# Altium project Robot_board.PrjPCB
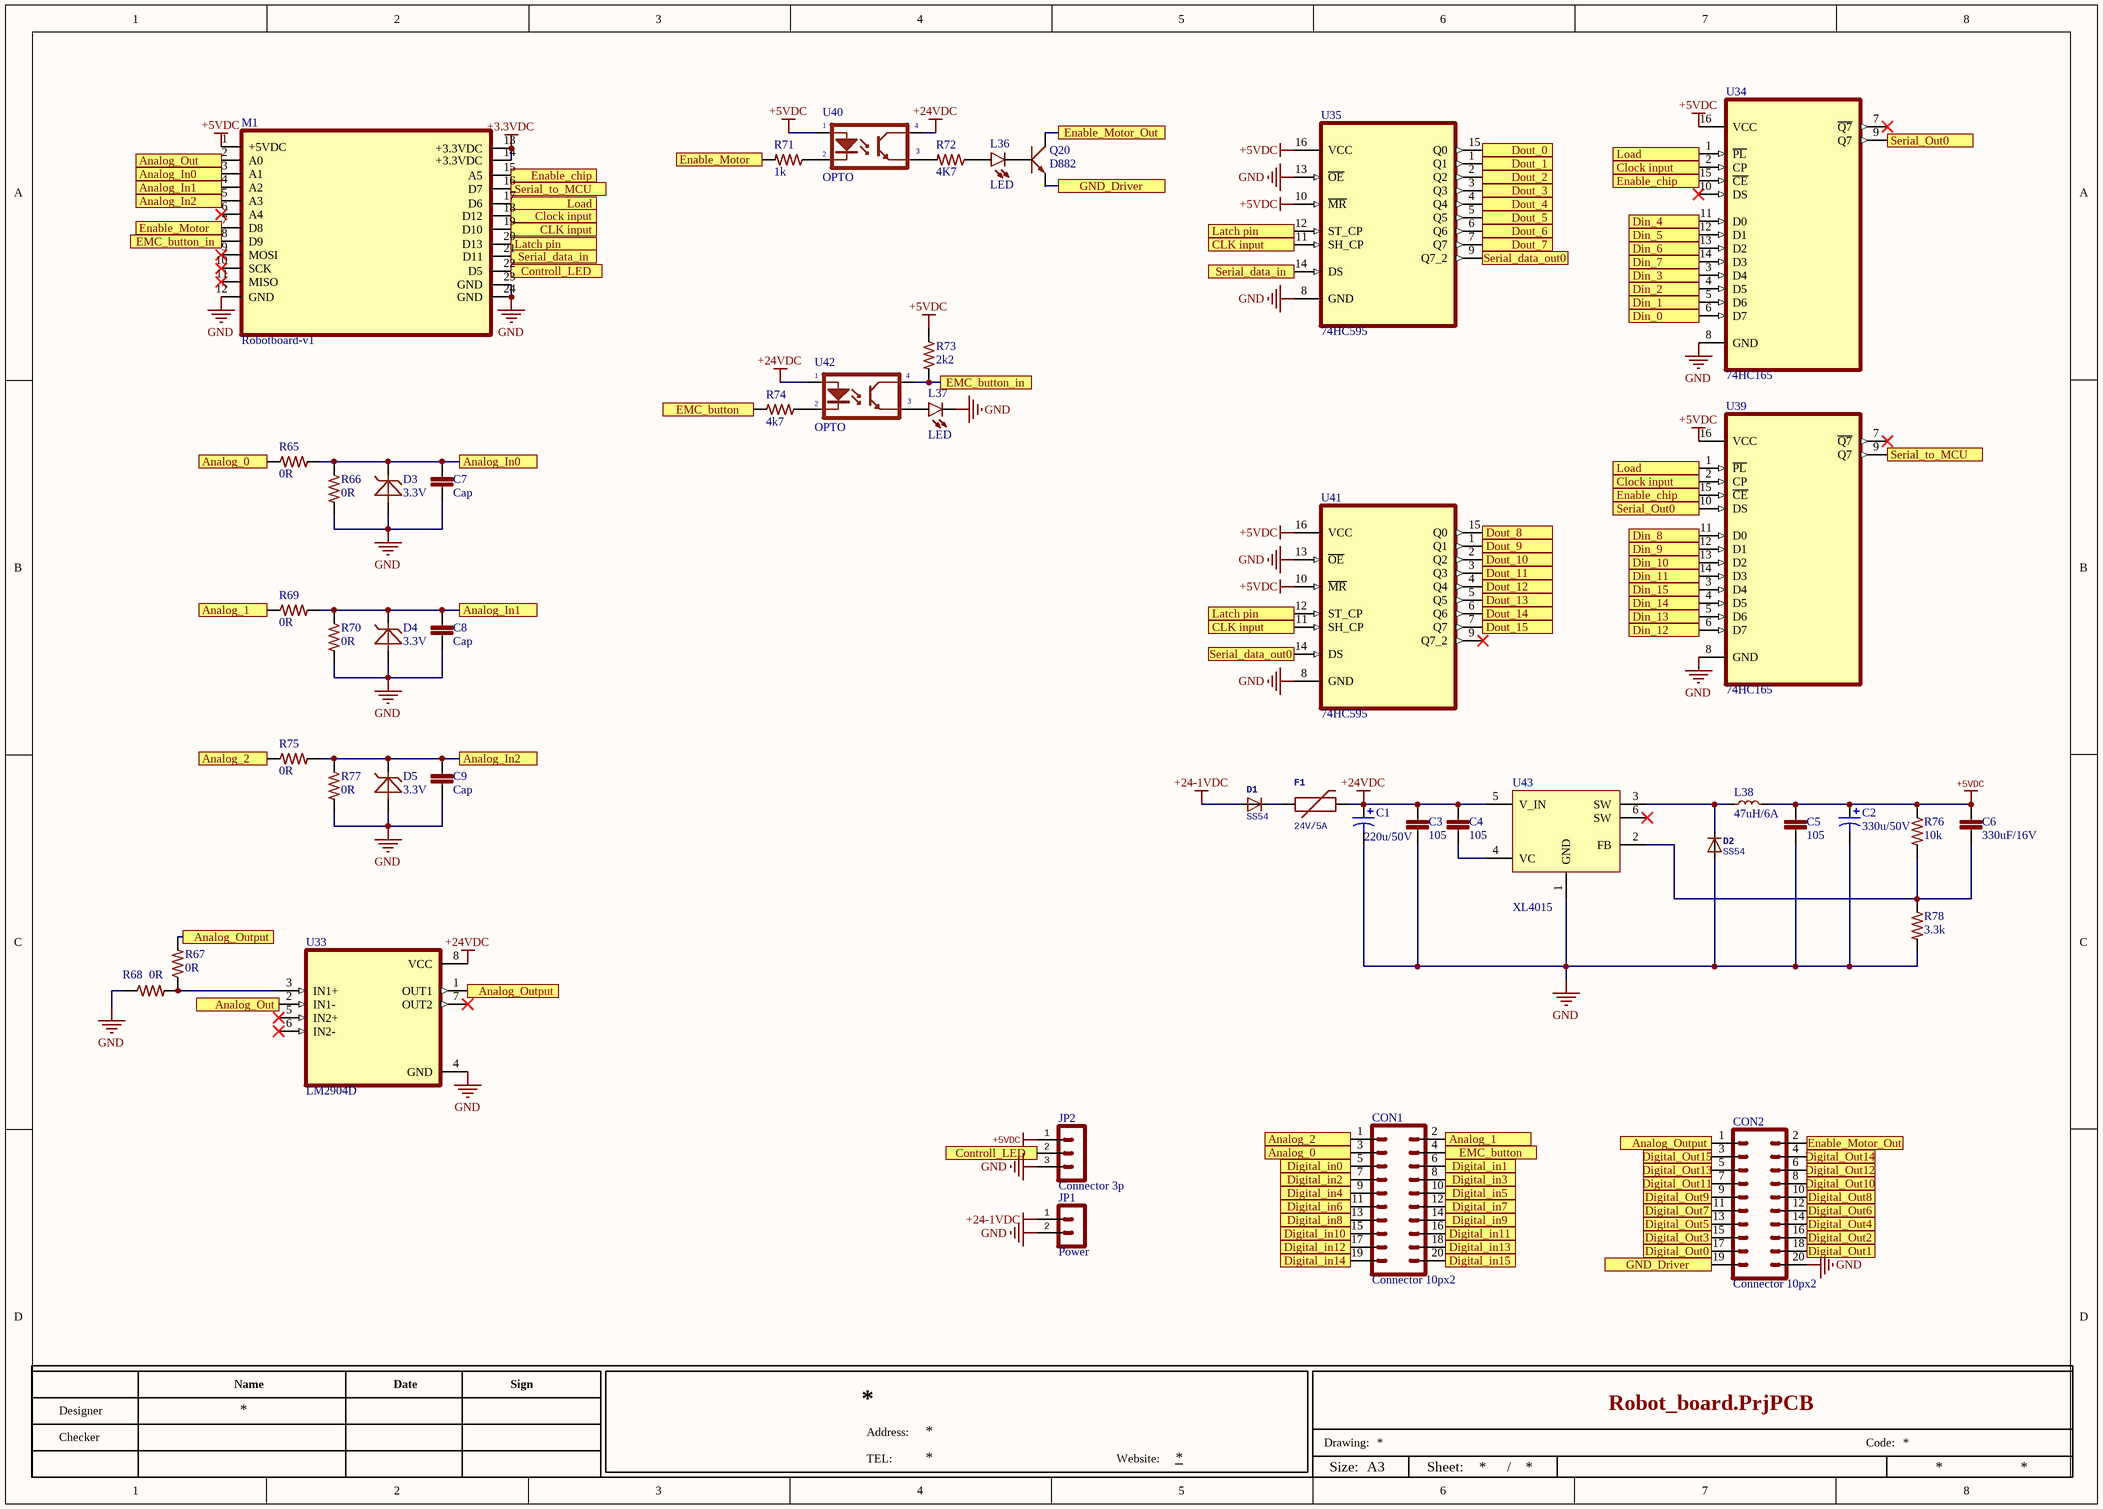
[diagram p0: Robot_board.SchDoc]
2 sheets, 190 parts. Net scope: flat (ports and power ports of the same name join across sheets).
Board file: robot.PcbDoc
Sheets:
  Robot_board.SchDoc
  In_Out.SchDoc

## Sheet Robot_board.SchDoc
size A3

### Parts
C1  220u/50V  [CAP_SMD_8x10]
C2  330u/50V  [CAP_SMD_8x10]
C3  105  [CAP_SMD0603]
C4  105  [CAP_SMD0603]
C5  105  [CAP_SMD0603]
C6  330uF/16V  [CAP_SMD0603]
C7  Cap  [CAP_SMD0603]
C8  Cap  [CAP_SMD0603]
C9  Cap  [CAP_SMD0603]
CON1  Connector 10px2  [DG24-2KDS]
CON2  Connector 10px2  [DG24-2KDS]
D1  SS54  [SMB]
D2  SS54  [SMB]
D3  3.3V  [DIODE_ZENER_SMD]
D4  3.3V  [DIODE_ZENER_SMD]
D5  3.3V  [DIODE_ZENER_SMD]
F1  24V/5A  [1206]
JP1  Power  [KF-128_2P]
JP2  Connector 3p  [KF-128_3P]
L36  LED  [LED_GREEN_SMD_0603]
L37  LED  [LED_RED_SMD_0603]
L38  47uH/6A  [Inductor_47uH_6A]
M1  Robotboard-v1  [ROBOTBOARD_V1]
Q20  D882  [SOT89]
R65  0R  [RES_SMD0603]
R66  0R  [RES_SMD0603]
R67  0R  [RES_SMD0603]
R68  0R  [RES_SMD0603]
R69  0R  [RES_SMD0603]
R70  0R  [RES_SMD0603]
R71  1k  [RES_SMD0603]
R72  4K7  [RES_SMD0603]
R73  2k2  [RES_SMD0603]
R74  4k7  [RES_SMD0603]
R75  0R  [RES_SMD0603]
R76  10k  [RES_SMD0603]
R77  0R  [RES_SMD0603]
R78  3.3k  [RES_SMD0603]
U33  LM2904D  [SOIC 8]
U34  74HC165  [SOIC16]
U35  74HC595  [SOIC16]
U39  74HC165  [SOIC16]
U40  OPTO  [SOP4]
U41  74HC595  [SOIC16]
U42  OPTO  [SOP4]
U43  XL4015  [TO-263-5]

### Ports
Analog_0, Analog_1, Analog_2, Analog_In0, Analog_In1, Analog_In2, Analog_Out, Analog_Output, CLK input, Clock input, Controll_LED, Digital_in0, Digital_in1, Digital_in2, Digital_in3, Digital_in4, Digital_in5, Digital_in6, Digital_in7, Digital_in8, Digital_in9, Digital_in10, Digital_in11, Digital_in12, Digital_in13, Digital_in14, Digital_in15, Digital_Out0, Digital_Out1, Digital_Out2, Digital_Out3, Digital_Out4, Digital_Out5, Digital_Out6, Digital_Out7, Digital_Out8, Digital_Out9, Digital_Out10, Digital_Out11, Digital_Out12, Digital_Out13, Digital_Out14, Digital_Out15, Din_0, Din_1, Din_2, Din_3, Din_4, Din_5, Din_6, Din_7, Din_8, Din_9, Din_10, Din_11, Din_12, Din_13, Din_14, Din_15, Dout_0, Dout_1, Dout_2, Dout_3, Dout_4, Dout_5, Dout_6, Dout_7, Dout_8, Dout_9, Dout_10, Dout_11, Dout_12, Dout_13, Dout_14, Dout_15, EMC_button, EMC_button_in, Enable_chip, Enable_Motor, Enable_Motor_Out, GND_Driver, Latch pin, Load, Serial_data_in, Serial_data_out0, Serial_Out0, Serial_to_MCU

### Nets
+3.3VDC: M1.13(+3.3VDC) M1.14(+3.3VDC)
+5VDC: C2.1 C5.1 C6.1 JP2.1 L38.2 M1.1(+5VDC) R73.1 R76.1 U34.16(VCC) U35.10(~{MR}) U35.16(VCC) U39.16(VCC) U40.1(A) U41.10(~{MR}) U41.16(VCC)
+24-1VDC: D1.1 JP1.1
+24VDC: C1.1 C3.1 C4.1 F1.2 U33.8(VCC) U40.4(C) U42.1(A) U43.5(V_IN)
GND: C1.2 C2.2 C3.2 C5.2 C7.1 C8.1 C9.1 CON2.20 D2.1 D3.1 D4.1 D5.1 JP1.2 JP2.3 L37.2(POS) M1.12(GND) M1.23(GND) M1.24(GND) R66.2 R68.1 R70.2 R77.2 R78.2 U33.4(GND) U34.8(GND) U35.8(GND) U35.13(~{OE}) U39.8(GND) U41.8(GND) U41.13(~{OE}) U43.1(GND)
NetC4_2: C4.2 U43.4(VC)
NetC6_2: C6.2 R76.2 R78.1 U43.2(FB)
NetC7_2: C7.2 D3.2 M1.3(A1) R65.2 R66.1 ; port Analog_In0
NetC8_2: C8.2 D4.2 M1.4(A2) R69.2 R70.1 ; port Analog_In1
NetC9_2: C9.2 D5.2 M1.5(A3) R75.2 R77.1 ; port Analog_In2
NetCON1_1: CON1.1 R75.1 ; port Analog_2
NetCON1_2: CON1.2 R69.1 ; port Analog_1
NetCON1_3: CON1.3 R65.1 ; port Analog_0
NetCON1_4: CON1.4 R74.2 ; port EMC_button
NetCON1_5: CON1.5 ; port Digital_in0
NetCON1_6: CON1.6 ; port Digital_in1
NetCON1_7: CON1.7 ; port Digital_in2
NetCON1_8: CON1.8 ; port Digital_in3
NetCON1_9: CON1.9 ; port Digital_in4
NetCON1_10: CON1.10 ; port Digital_in5
NetCON1_11: CON1.11 ; port Digital_in6
NetCON1_12: CON1.12 ; port Digital_in7
NetCON1_13: CON1.13 ; port Digital_in8
NetCON1_14: CON1.14 ; port Digital_in9
NetCON1_15: CON1.15 ; port Digital_in10
NetCON1_16: CON1.16 ; port Digital_in11
NetCON1_17: CON1.17 ; port Digital_in12
NetCON1_18: CON1.18 ; port Digital_in13
NetCON1_19: CON1.19 ; port Digital_in14
NetCON1_20: CON1.20 ; port Digital_in15
NetCON2_1: CON2.1 R67.2 U33.1(OUT1) ; port Analog_Output
NetCON2_2: CON2.2 Q20.3(COLLECTOR) ; port Enable_Motor_Out
NetCON2_3: CON2.3 ; port Digital_Out15
NetCON2_4: CON2.4 ; port Digital_Out14
NetCON2_5: CON2.5 ; port Digital_Out13
NetCON2_6: CON2.6 ; port Digital_Out12
NetCON2_7: CON2.7 ; port Digital_Out11
NetCON2_8: CON2.8 ; port Digital_Out10
NetCON2_9: CON2.9 ; port Digital_Out9
NetCON2_10: CON2.10 ; port Digital_Out8
NetCON2_11: CON2.11 ; port Digital_Out7
NetCON2_12: CON2.12 ; port Digital_Out6
NetCON2_13: CON2.13 ; port Digital_Out5
NetCON2_14: CON2.14 ; port Digital_Out4
NetCON2_15: CON2.15 ; port Digital_Out3
NetCON2_16: CON2.16 ; port Digital_Out2
NetCON2_17: CON2.17 ; port Digital_Out0
NetCON2_18: CON2.18 ; port Digital_Out1
NetCON2_19: CON2.19 Q20.2(EMITTER) ; port GND_Driver
NetD1_2: D1.2 F1.1
NetD2_2: D2.2 L38.1 U43.3(SW)
NetJP2_2: JP2.2 M1.22(D5) ; port Controll_LED
NetL36_1: L36.1(NEG) R72.1
NetL36_2: L36.2(POS) Q20.1(BASE)
NetL37_1: L37.1(NEG) U42.3(E)
NetM1_2: M1.2(A0) U33.2(IN1-) ; port Analog_Out
NetM1_7: M1.7(D8) R71.2 ; port Enable_Motor
NetM1_8: M1.8(D9) R73.2 U42.4(C) ; port EMC_button_in
NetM1_15: M1.15(A5) U34.15(~{CE}) U39.15(~{CE}) ; port Enable_chip
NetM1_16: M1.16(D7) U39.9(Q7) ; port Serial_to_MCU
NetM1_17: M1.17(D6) U34.1(~{PL}) U39.1(~{PL}) ; port Load
NetM1_18: M1.18(D12) U34.2(CP) U39.2(CP) ; port Clock input
NetM1_19: M1.19(D10) U35.11(SH_CP) U41.11(SH_CP) ; port CLK input
NetM1_20: M1.20(D13) U35.12(ST_CP) U41.12(ST_CP) ; port Latch pin
NetM1_21: M1.21(D11) U35.14(DS) ; port Serial_data_in
NetR1_2: U35.15(Q0) ; port Dout_0
NetR2_2: U41.15(Q0) ; port Dout_8
NetR3_2: U34.6(D7) ; port Din_0
NetR4_2: U39.11(D0) ; port Din_8
NetR9_2: U35.1(Q1) ; port Dout_1
NetR10_2: U41.1(Q1) ; port Dout_9
NetR13_2: U34.5(D6) ; port Din_1
NetR14_2: U39.12(D1) ; port Din_9
NetR17_2: U35.2(Q2) ; port Dout_2
NetR18_2: U41.2(Q2) ; port Dout_10
NetR19_2: U34.4(D5) ; port Din_2
NetR20_2: U39.13(D2) ; port Din_10
NetR25_2: U35.3(Q3) ; port Dout_3
NetR26_2: U41.3(Q3) ; port Dout_11
NetR27_2: U34.3(D4) ; port Din_3
NetR28_2: U39.14(D3) ; port Din_11
NetR33_2: U34.11(D0) ; port Din_4
NetR34_2: U39.6(D7) ; port Din_12
NetR35_2: U35.4(Q4) ; port Dout_4
NetR36_2: U41.4(Q4) ; port Dout_12
NetR41_2: U34.12(D1) ; port Din_5
NetR42_2: U39.5(D6) ; port Din_13
NetR43_2: U35.5(Q5) ; port Dout_5
NetR44_2: U41.5(Q5) ; port Dout_13
NetR49_2: U34.13(D2) ; port Din_6
NetR50_2: U39.4(D5) ; port Din_14
NetR51_2: U35.6(Q6) ; port Dout_6
NetR52_2: U41.6(Q6) ; port Dout_14
NetR57_2: U34.14(D3) ; port Din_7
NetR58_2: U39.3(D4) ; port Din_15
NetR59_2: U35.7(Q7) ; port Dout_7
NetR60_2: U41.7(Q7) ; port Dout_15
NetR67_1: R67.1 R68.2 U33.3(IN1+)
NetR71_1: R71.1 U40.2(K)
NetR72_2: R72.2 U40.3(E)
NetR74_1: R74.1 U42.2(K)
NetU34_9: U34.9(Q7) U39.10(DS) ; port Serial_Out0
NetU35_9: U35.9(Q7_2) U41.14(DS) ; port Serial_data_out0

Not connected (* = marked no-connect by the designer): M1 6(A4)* 9(MOSI)* 10(SCK)* 11(MISO)*; U33 5(IN2+)* 6(IN2-)* 7(OUT2)*; U34 7(~{Q7})* 10(DS)*; U39 7(~{Q7})*; U41 9(Q7_2)*; U43 6(SW)*

### Notes on the sheet
- Name
- Date
- Sign
- Designer
- Checker
- Address:
- TEL:
- Website:
- Drawing:
- Size:
- A3
- Sheet:
- /
- Code:

### Library data of the parts
C1 C2 = Cap_Pol
C3-C6 = Cap
D1 D2 = DIODE
D3-D5 = DIODE_ZENER: Diode
F1 = Fuse
JP1 = Connector 2p
L36 L37 = LED: Lighting Eminter Diode
L38 = Inductors
Q20 = Tranzitor NPN: pin to pad: 2>3 3>2
R65-R78 = Resistor

## Sheet In_Out.SchDoc
size A3
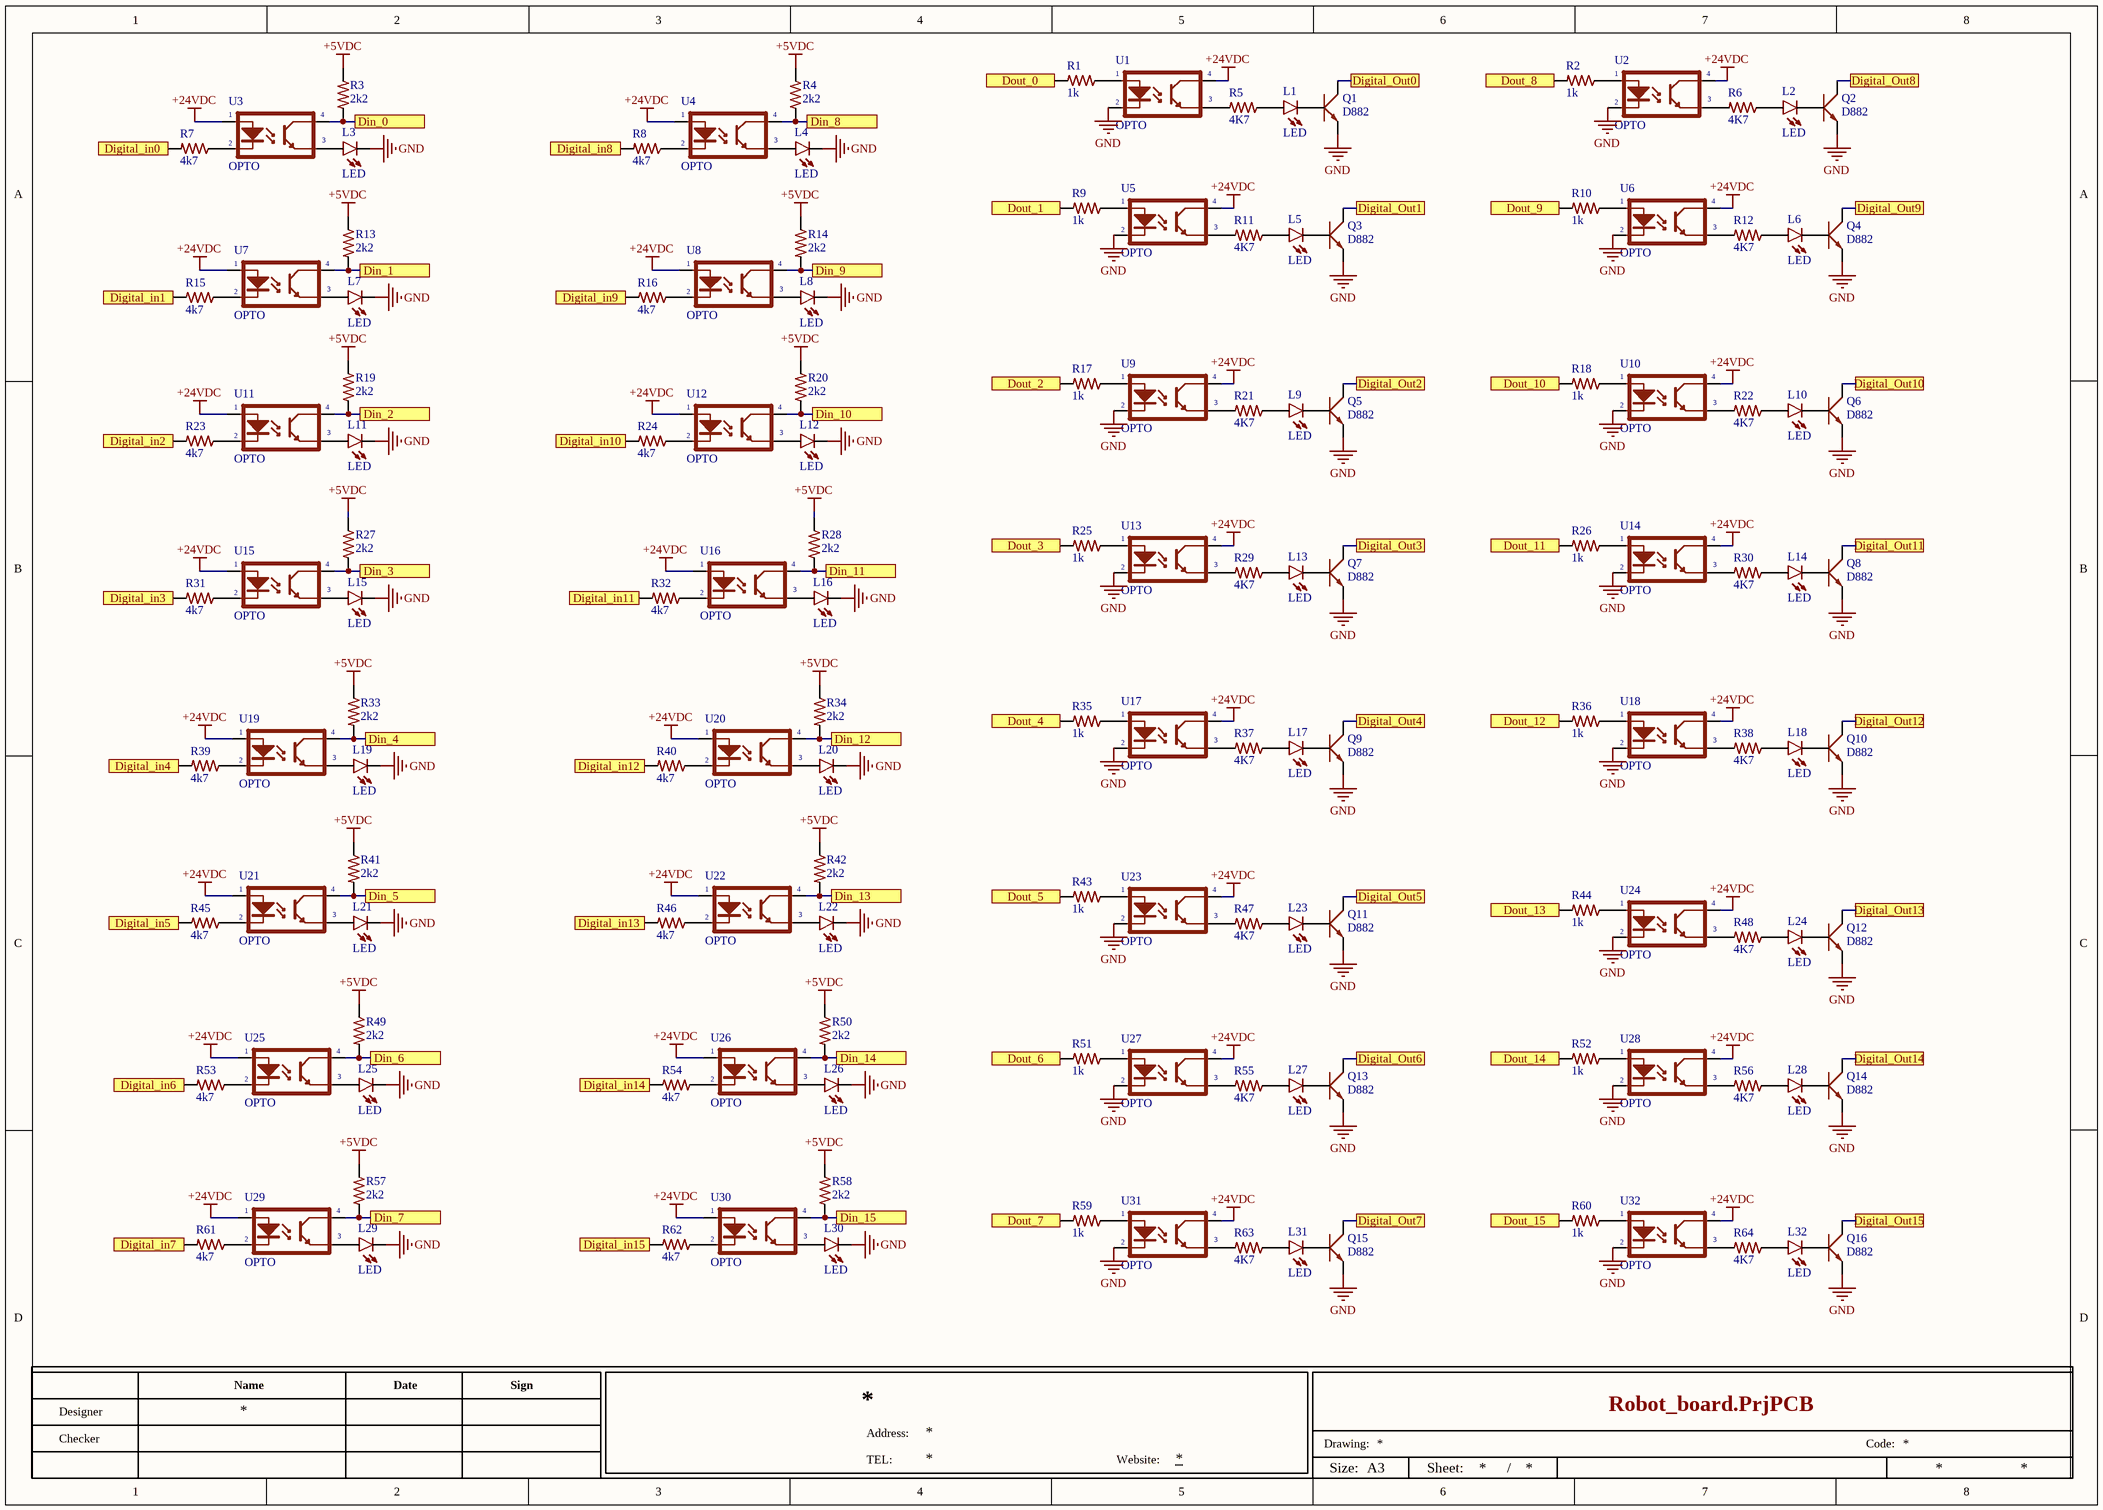
[diagram p1: In_Out.SchDoc]

### Parts
L1  LED  [LED_GREEN_SMD_0603]
L2  LED  [LED_GREEN_SMD_0603]
L3  LED  [LED_RED_SMD_0603]
L4  LED  [LED_RED_SMD_0603]
L5  LED  [LED_GREEN_SMD_0603]
L6  LED  [LED_GREEN_SMD_0603]
L7  LED  [LED_RED_SMD_0603]
L8  LED  [LED_RED_SMD_0603]
L9  LED  [LED_GREEN_SMD_0603]
L10  LED  [LED_GREEN_SMD_0603]
L11  LED  [LED_RED_SMD_0603]
L12  LED  [LED_RED_SMD_0603]
L13  LED  [LED_GREEN_SMD_0603]
L14  LED  [LED_GREEN_SMD_0603]
L15  LED  [LED_RED_SMD_0603]
L16  LED  [LED_RED_SMD_0603]
L17  LED  [LED_GREEN_SMD_0603]
L18  LED  [LED_GREEN_SMD_0603]
L19  LED  [LED_RED_SMD_0603]
L20  LED  [LED_RED_SMD_0603]
L21  LED  [LED_RED_SMD_0603]
L22  LED  [LED_RED_SMD_0603]
L23  LED  [LED_GREEN_SMD_0603]
L24  LED  [LED_GREEN_SMD_0603]
L25  LED  [LED_RED_SMD_0603]
L26  LED  [LED_RED_SMD_0603]
L27  LED  [LED_GREEN_SMD_0603]
L28  LED  [LED_GREEN_SMD_0603]
L29  LED  [LED_RED_SMD_0603]
L30  LED  [LED_RED_SMD_0603]
L31  LED  [LED_GREEN_SMD_0603]
L32  LED  [LED_GREEN_SMD_0603]
Q1  D882  [SOT89]
Q2  D882  [SOT89]
Q3  D882  [SOT89]
Q4  D882  [SOT89]
Q5  D882  [SOT89]
Q6  D882  [SOT89]
Q7  D882  [SOT89]
Q8  D882  [SOT89]
Q9  D882  [SOT89]
Q10  D882  [SOT89]
Q11  D882  [SOT89]
Q12  D882  [SOT89]
Q13  D882  [SOT89]
Q14  D882  [SOT89]
Q15  D882  [SOT89]
Q16  D882  [SOT89]
R1  1k  [RES_SMD0603]
R2  1k  [RES_SMD0603]
R3  2k2  [RES_SMD0603]
R4  2k2  [RES_SMD0603]
R5  4K7  [RES_SMD0603]
R6  4K7  [RES_SMD0603]
R7  4k7  [RES_SMD0603]
R8  4k7  [RES_SMD0603]
R9  1k  [RES_SMD0603]
R10  1k  [RES_SMD0603]
R11  4K7  [RES_SMD0603]
R12  4K7  [RES_SMD0603]
R13  2k2  [RES_SMD0603]
R14  2k2  [RES_SMD0603]
R15  4k7  [RES_SMD0603]
R16  4k7  [RES_SMD0603]
R17  1k  [RES_SMD0603]
R18  1k  [RES_SMD0603]
R19  2k2  [RES_SMD0603]
R20  2k2  [RES_SMD0603]
R21  4K7  [RES_SMD0603]
R22  4K7  [RES_SMD0603]
R23  4k7  [RES_SMD0603]
R24  4k7  [RES_SMD0603]
R25  1k  [RES_SMD0603]
R26  1k  [RES_SMD0603]
R27  2k2  [RES_SMD0603]
R28  2k2  [RES_SMD0603]
R29  4K7  [RES_SMD0603]
R30  4K7  [RES_SMD0603]
R31  4k7  [RES_SMD0603]
R32  4k7  [RES_SMD0603]
R33  2k2  [RES_SMD0603]
R34  2k2  [RES_SMD0603]
R35  1k  [RES_SMD0603]
R36  1k  [RES_SMD0603]
R37  4K7  [RES_SMD0603]
R38  4K7  [RES_SMD0603]
R39  4k7  [RES_SMD0603]
R40  4k7  [RES_SMD0603]
R41  2k2  [RES_SMD0603]
R42  2k2  [RES_SMD0603]
R43  1k  [RES_SMD0603]
R44  1k  [RES_SMD0603]
R45  4k7  [RES_SMD0603]
R46  4k7  [RES_SMD0603]
R47  4K7  [RES_SMD0603]
R48  4K7  [RES_SMD0603]
R49  2k2  [RES_SMD0603]
R50  2k2  [RES_SMD0603]
R51  1k  [RES_SMD0603]
R52  1k  [RES_SMD0603]
R53  4k7  [RES_SMD0603]
R54  4k7  [RES_SMD0603]
R55  4K7  [RES_SMD0603]
R56  4K7  [RES_SMD0603]
R57  2k2  [RES_SMD0603]
R58  2k2  [RES_SMD0603]
R59  1k  [RES_SMD0603]
R60  1k  [RES_SMD0603]
R61  4k7  [RES_SMD0603]
R62  4k7  [RES_SMD0603]
R63  4K7  [RES_SMD0603]
R64  4K7  [RES_SMD0603]
U1  OPTO  [SOP4]
U2  OPTO  [SOP4]
U3  OPTO  [SOP4]
U4  OPTO  [SOP4]
U5  OPTO  [SOP4]
U6  OPTO  [SOP4]
U7  OPTO  [SOP4]
U8  OPTO  [SOP4]
U9  OPTO  [SOP4]
U10  OPTO  [SOP4]
U11  OPTO  [SOP4]
U12  OPTO  [SOP4]
U13  OPTO  [SOP4]
U14  OPTO  [SOP4]
U15  OPTO  [SOP4]
U16  OPTO  [SOP4]
U17  OPTO  [SOP4]
U18  OPTO  [SOP4]
U19  OPTO  [SOP4]
U20  OPTO  [SOP4]
U21  OPTO  [SOP4]
U22  OPTO  [SOP4]
U23  OPTO  [SOP4]
U24  OPTO  [SOP4]
U25  OPTO  [SOP4]
U26  OPTO  [SOP4]
U27  OPTO  [SOP4]
U28  OPTO  [SOP4]
U29  OPTO  [SOP4]
U30  OPTO  [SOP4]
U31  OPTO  [SOP4]
U32  OPTO  [SOP4]

### Ports
Digital_in0, Digital_in1, Digital_in2, Digital_in3, Digital_in4, Digital_in5, Digital_in6, Digital_in7, Digital_in8, Digital_in9, Digital_in10, Digital_in11, Digital_in12, Digital_in13, Digital_in14, Digital_in15, Digital_Out0, Digital_Out1, Digital_Out2, Digital_Out3, Digital_Out4, Digital_Out5, Digital_Out6, Digital_Out7, Digital_Out8, Digital_Out9, Digital_Out10, Digital_Out11, Digital_Out12, Digital_Out13, Digital_Out14, Digital_Out15, Din_0, Din_1, Din_2, Din_3, Din_4, Din_5, Din_6, Din_7, Din_8, Din_9, Din_10, Din_11, Din_12, Din_13, Din_14, Din_15, Dout_0, Dout_1, Dout_2, Dout_3, Dout_4, Dout_5, Dout_6, Dout_7, Dout_8, Dout_9, Dout_10, Dout_11, Dout_12, Dout_13, Dout_14, Dout_15

### Nets
+5VDC: R3.1 R4.1 R13.1 R14.1 R19.1 R20.1 R27.1 R28.1 R33.1 R34.1 R41.1 R42.1 R49.1 R50.1 R57.1 R58.1
+24VDC: U1.4(C) U2.4(C) U3.1(A) U4.1(A) U5.4(C) U6.4(C) U7.1(A) U8.1(A) U9.4(C) U10.4(C) U11.1(A) U12.1(A) U13.4(C) U14.4(C) U15.1(A) U16.1(A) U17.4(C) U18.4(C) U19.1(A) U20.1(A) U21.1(A) U22.1(A) U23.4(C) U24.4(C) U25.1(A) U26.1(A) U27.4(C) U28.4(C) U29.1(A) U30.1(A) U31.4(C) U32.4(C)
GND: L3.2(POS) L4.2(POS) L7.2(POS) L8.2(POS) L11.2(POS) L12.2(POS) L15.2(POS) L16.2(POS) L19.2(POS) L20.2(POS) L21.2(POS) L22.2(POS) L25.2(POS) L26.2(POS) L29.2(POS) L30.2(POS) Q1.2(EMITTER) Q2.2(EMITTER) Q3.2(EMITTER) Q4.2(EMITTER) Q5.2(EMITTER) Q6.2(EMITTER) Q7.2(EMITTER) Q8.2(EMITTER) Q9.2(EMITTER) Q10.2(EMITTER) Q11.2(EMITTER) Q12.2(EMITTER) Q13.2(EMITTER) Q14.2(EMITTER) Q15.2(EMITTER) Q16.2(EMITTER) U1.2(K) U2.2(K) U5.2(K) U6.2(K) U9.2(K) U10.2(K) U13.2(K) U14.2(K) U17.2(K) U18.2(K) U23.2(K) U24.2(K) U27.2(K) U28.2(K) U31.2(K) U32.2(K)
NetCON1_5: R7.2 ; port Digital_in0
NetCON1_6: R15.2 ; port Digital_in1
NetCON1_7: R23.2 ; port Digital_in2
NetCON1_8: R31.2 ; port Digital_in3
NetCON1_9: R39.2 ; port Digital_in4
NetCON1_10: R45.2 ; port Digital_in5
NetCON1_11: R53.2 ; port Digital_in6
NetCON1_12: R61.2 ; port Digital_in7
NetCON1_13: R8.2 ; port Digital_in8
NetCON1_14: R16.2 ; port Digital_in9
NetCON1_15: R24.2 ; port Digital_in10
NetCON1_16: R32.2 ; port Digital_in11
NetCON1_17: R40.2 ; port Digital_in12
NetCON1_18: R46.2 ; port Digital_in13
NetCON1_19: R54.2 ; port Digital_in14
NetCON1_20: R62.2 ; port Digital_in15
NetCON2_3: Q16.3(COLLECTOR) ; port Digital_Out15
NetCON2_4: Q14.3(COLLECTOR) ; port Digital_Out14
NetCON2_5: Q12.3(COLLECTOR) ; port Digital_Out13
NetCON2_6: Q10.3(COLLECTOR) ; port Digital_Out12
NetCON2_7: Q8.3(COLLECTOR) ; port Digital_Out11
NetCON2_8: Q6.3(COLLECTOR) ; port Digital_Out10
NetCON2_9: Q4.3(COLLECTOR) ; port Digital_Out9
NetCON2_10: Q2.3(COLLECTOR) ; port Digital_Out8
NetCON2_11: Q15.3(COLLECTOR) ; port Digital_Out7
NetCON2_12: Q13.3(COLLECTOR) ; port Digital_Out6
NetCON2_13: Q11.3(COLLECTOR) ; port Digital_Out5
NetCON2_14: Q9.3(COLLECTOR) ; port Digital_Out4
NetCON2_15: Q7.3(COLLECTOR) ; port Digital_Out3
NetCON2_16: Q5.3(COLLECTOR) ; port Digital_Out2
NetCON2_17: Q1.3(COLLECTOR) ; port Digital_Out0
NetCON2_18: Q3.3(COLLECTOR) ; port Digital_Out1
NetL1_1: L1.1(NEG) R5.1
NetL1_2: L1.2(POS) Q1.1(BASE)
NetL2_1: L2.1(NEG) R6.1
NetL2_2: L2.2(POS) Q2.1(BASE)
NetL3_1: L3.1(NEG) U3.3(E)
NetL4_1: L4.1(NEG) U4.3(E)
NetL5_1: L5.1(NEG) R11.1
NetL5_2: L5.2(POS) Q3.1(BASE)
NetL6_1: L6.1(NEG) R12.1
NetL6_2: L6.2(POS) Q4.1(BASE)
NetL7_1: L7.1(NEG) U7.3(E)
NetL8_1: L8.1(NEG) U8.3(E)
NetL9_1: L9.1(NEG) R21.1
NetL9_2: L9.2(POS) Q5.1(BASE)
NetL10_1: L10.1(NEG) R22.1
NetL10_2: L10.2(POS) Q6.1(BASE)
NetL11_1: L11.1(NEG) U11.3(E)
NetL12_1: L12.1(NEG) U12.3(E)
NetL13_1: L13.1(NEG) R29.1
NetL13_2: L13.2(POS) Q7.1(BASE)
NetL14_1: L14.1(NEG) R30.1
NetL14_2: L14.2(POS) Q8.1(BASE)
NetL15_1: L15.1(NEG) U15.3(E)
NetL16_1: L16.1(NEG) U16.3(E)
NetL17_1: L17.1(NEG) R37.1
NetL17_2: L17.2(POS) Q9.1(BASE)
NetL18_1: L18.1(NEG) R38.1
NetL18_2: L18.2(POS) Q10.1(BASE)
NetL19_1: L19.1(NEG) U19.3(E)
NetL20_1: L20.1(NEG) U20.3(E)
NetL21_1: L21.1(NEG) U21.3(E)
NetL22_1: L22.1(NEG) U22.3(E)
NetL23_1: L23.1(NEG) R47.1
NetL23_2: L23.2(POS) Q11.1(BASE)
NetL24_1: L24.1(NEG) R48.1
NetL24_2: L24.2(POS) Q12.1(BASE)
NetL25_1: L25.1(NEG) U25.3(E)
NetL26_1: L26.1(NEG) U26.3(E)
NetL27_1: L27.1(NEG) R55.1
NetL27_2: L27.2(POS) Q13.1(BASE)
NetL28_1: L28.1(NEG) R56.1
NetL28_2: L28.2(POS) Q14.1(BASE)
NetL29_1: L29.1(NEG) U29.3(E)
NetL30_1: L30.1(NEG) U30.3(E)
NetL31_1: L31.1(NEG) R63.1
NetL31_2: L31.2(POS) Q15.1(BASE)
NetL32_1: L32.1(NEG) R64.1
NetL32_2: L32.2(POS) Q16.1(BASE)
NetR1_1: R1.1 U1.1(A)
NetR1_2: R1.2 ; port Dout_0
NetR2_1: R2.1 U2.1(A)
NetR2_2: R2.2 ; port Dout_8
NetR3_2: R3.2 U3.4(C) ; port Din_0
NetR4_2: R4.2 U4.4(C) ; port Din_8
NetR5_2: R5.2 U1.3(E)
NetR6_2: R6.2 U2.3(E)
NetR7_1: R7.1 U3.2(K)
NetR8_1: R8.1 U4.2(K)
NetR9_1: R9.1 U5.1(A)
NetR9_2: R9.2 ; port Dout_1
NetR10_1: R10.1 U6.1(A)
NetR10_2: R10.2 ; port Dout_9
NetR11_2: R11.2 U5.3(E)
NetR12_2: R12.2 U6.3(E)
NetR13_2: R13.2 U7.4(C) ; port Din_1
NetR14_2: R14.2 U8.4(C) ; port Din_9
NetR15_1: R15.1 U7.2(K)
NetR16_1: R16.1 U8.2(K)
NetR17_1: R17.1 U9.1(A)
NetR17_2: R17.2 ; port Dout_2
NetR18_1: R18.1 U10.1(A)
NetR18_2: R18.2 ; port Dout_10
NetR19_2: R19.2 U11.4(C) ; port Din_2
NetR20_2: R20.2 U12.4(C) ; port Din_10
NetR21_2: R21.2 U9.3(E)
NetR22_2: R22.2 U10.3(E)
NetR23_1: R23.1 U11.2(K)
NetR24_1: R24.1 U12.2(K)
NetR25_1: R25.1 U13.1(A)
NetR25_2: R25.2 ; port Dout_3
NetR26_1: R26.1 U14.1(A)
NetR26_2: R26.2 ; port Dout_11
NetR27_2: R27.2 U15.4(C) ; port Din_3
NetR28_2: R28.2 U16.4(C) ; port Din_11
NetR29_2: R29.2 U13.3(E)
NetR30_2: R30.2 U14.3(E)
NetR31_1: R31.1 U15.2(K)
NetR32_1: R32.1 U16.2(K)
NetR33_2: R33.2 U19.4(C) ; port Din_4
NetR34_2: R34.2 U20.4(C) ; port Din_12
NetR35_1: R35.1 U17.1(A)
NetR35_2: R35.2 ; port Dout_4
NetR36_1: R36.1 U18.1(A)
NetR36_2: R36.2 ; port Dout_12
NetR37_2: R37.2 U17.3(E)
NetR38_2: R38.2 U18.3(E)
NetR39_1: R39.1 U19.2(K)
NetR40_1: R40.1 U20.2(K)
NetR41_2: R41.2 U21.4(C) ; port Din_5
NetR42_2: R42.2 U22.4(C) ; port Din_13
NetR43_1: R43.1 U23.1(A)
NetR43_2: R43.2 ; port Dout_5
NetR44_1: R44.1 U24.1(A)
NetR44_2: R44.2 ; port Dout_13
NetR45_1: R45.1 U21.2(K)
NetR46_1: R46.1 U22.2(K)
NetR47_2: R47.2 U23.3(E)
NetR48_2: R48.2 U24.3(E)
NetR49_2: R49.2 U25.4(C) ; port Din_6
NetR50_2: R50.2 U26.4(C) ; port Din_14
NetR51_1: R51.1 U27.1(A)
NetR51_2: R51.2 ; port Dout_6
NetR52_1: R52.1 U28.1(A)
NetR52_2: R52.2 ; port Dout_14
NetR53_1: R53.1 U25.2(K)
NetR54_1: R54.1 U26.2(K)
NetR55_2: R55.2 U27.3(E)
NetR56_2: R56.2 U28.3(E)
NetR57_2: R57.2 U29.4(C) ; port Din_7
NetR58_2: R58.2 U30.4(C) ; port Din_15
NetR59_1: R59.1 U31.1(A)
NetR59_2: R59.2 ; port Dout_7
NetR60_1: R60.1 U32.1(A)
NetR60_2: R60.2 ; port Dout_15
NetR61_1: R61.1 U29.2(K)
NetR62_1: R62.1 U30.2(K)
NetR63_2: R63.2 U31.3(E)
NetR64_2: R64.2 U32.3(E)

### Notes on the sheet
- Name
- Date
- Sign
- Designer
- Checker
- Address:
- TEL:
- Website:
- Drawing:
- Size:
- A3
- Sheet:
- /
- Code:

### Library data of the parts
L1-L32 = LED: Lighting Eminter Diode
Q1-Q16 = Tranzitor NPN: pin to pad: 2>3 3>2
R1-R64 = Resistor

## Nets that join several sheets
+5VDC: Robot_board (15 pins), In_Out (16 pins)
+24VDC: Robot_board (8 pins), In_Out (32 pins)
GND: Robot_board (31 pins), In_Out (48 pins)
NetCON1_5: Robot_board (CON1.5), In_Out (R7.2)
NetCON1_6: Robot_board (CON1.6), In_Out (R15.2)
NetCON1_7: Robot_board (CON1.7), In_Out (R23.2)
NetCON1_8: Robot_board (CON1.8), In_Out (R31.2)
NetCON1_9: Robot_board (CON1.9), In_Out (R39.2)
NetCON1_10: Robot_board (CON1.10), In_Out (R45.2)
NetCON1_11: Robot_board (CON1.11), In_Out (R53.2)
NetCON1_12: Robot_board (CON1.12), In_Out (R61.2)
NetCON1_13: Robot_board (CON1.13), In_Out (R8.2)
NetCON1_14: Robot_board (CON1.14), In_Out (R16.2)
NetCON1_15: Robot_board (CON1.15), In_Out (R24.2)
NetCON1_16: Robot_board (CON1.16), In_Out (R32.2)
NetCON1_17: Robot_board (CON1.17), In_Out (R40.2)
NetCON1_18: Robot_board (CON1.18), In_Out (R46.2)
NetCON1_19: Robot_board (CON1.19), In_Out (R54.2)
NetCON1_20: Robot_board (CON1.20), In_Out (R62.2)
NetCON2_3: Robot_board (CON2.3), In_Out (Q16.3)
NetCON2_4: Robot_board (CON2.4), In_Out (Q14.3)
NetCON2_5: Robot_board (CON2.5), In_Out (Q12.3)
NetCON2_6: Robot_board (CON2.6), In_Out (Q10.3)
NetCON2_7: Robot_board (CON2.7), In_Out (Q8.3)
NetCON2_8: Robot_board (CON2.8), In_Out (Q6.3)
NetCON2_9: Robot_board (CON2.9), In_Out (Q4.3)
NetCON2_10: Robot_board (CON2.10), In_Out (Q2.3)
NetCON2_11: Robot_board (CON2.11), In_Out (Q15.3)
NetCON2_12: Robot_board (CON2.12), In_Out (Q13.3)
NetCON2_13: Robot_board (CON2.13), In_Out (Q11.3)
NetCON2_14: Robot_board (CON2.14), In_Out (Q9.3)
NetCON2_15: Robot_board (CON2.15), In_Out (Q7.3)
NetCON2_16: Robot_board (CON2.16), In_Out (Q5.3)
NetCON2_17: Robot_board (CON2.17), In_Out (Q1.3)
NetCON2_18: Robot_board (CON2.18), In_Out (Q3.3)
NetR1_2: Robot_board (U35.15), In_Out (R1.2)
NetR2_2: Robot_board (U41.15), In_Out (R2.2)
NetR3_2: Robot_board (U34.6), In_Out (R3.2 U3.4)
NetR4_2: Robot_board (U39.11), In_Out (R4.2 U4.4)
NetR9_2: Robot_board (U35.1), In_Out (R9.2)
NetR10_2: Robot_board (U41.1), In_Out (R10.2)
NetR13_2: Robot_board (U34.5), In_Out (R13.2 U7.4)
NetR14_2: Robot_board (U39.12), In_Out (R14.2 U8.4)
NetR17_2: Robot_board (U35.2), In_Out (R17.2)
NetR18_2: Robot_board (U41.2), In_Out (R18.2)
NetR19_2: Robot_board (U34.4), In_Out (R19.2 U11.4)
NetR20_2: Robot_board (U39.13), In_Out (R20.2 U12.4)
NetR25_2: Robot_board (U35.3), In_Out (R25.2)
NetR26_2: Robot_board (U41.3), In_Out (R26.2)
NetR27_2: Robot_board (U34.3), In_Out (R27.2 U15.4)
NetR28_2: Robot_board (U39.14), In_Out (R28.2 U16.4)
NetR33_2: Robot_board (U34.11), In_Out (R33.2 U19.4)
NetR34_2: Robot_board (U39.6), In_Out (R34.2 U20.4)
NetR35_2: Robot_board (U35.4), In_Out (R35.2)
NetR36_2: Robot_board (U41.4), In_Out (R36.2)
NetR41_2: Robot_board (U34.12), In_Out (R41.2 U21.4)
NetR42_2: Robot_board (U39.5), In_Out (R42.2 U22.4)
NetR43_2: Robot_board (U35.5), In_Out (R43.2)
NetR44_2: Robot_board (U41.5), In_Out (R44.2)
NetR49_2: Robot_board (U34.13), In_Out (R49.2 U25.4)
NetR50_2: Robot_board (U39.4), In_Out (R50.2 U26.4)
NetR51_2: Robot_board (U35.6), In_Out (R51.2)
NetR52_2: Robot_board (U41.6), In_Out (R52.2)
NetR57_2: Robot_board (U34.14), In_Out (R57.2 U29.4)
NetR58_2: Robot_board (U39.3), In_Out (R58.2 U30.4)
NetR59_2: Robot_board (U35.7), In_Out (R59.2)
NetR60_2: Robot_board (U41.7), In_Out (R60.2)